# EAGLE design BLL-EBOOK-3506B (EAGLE 9.6.2)
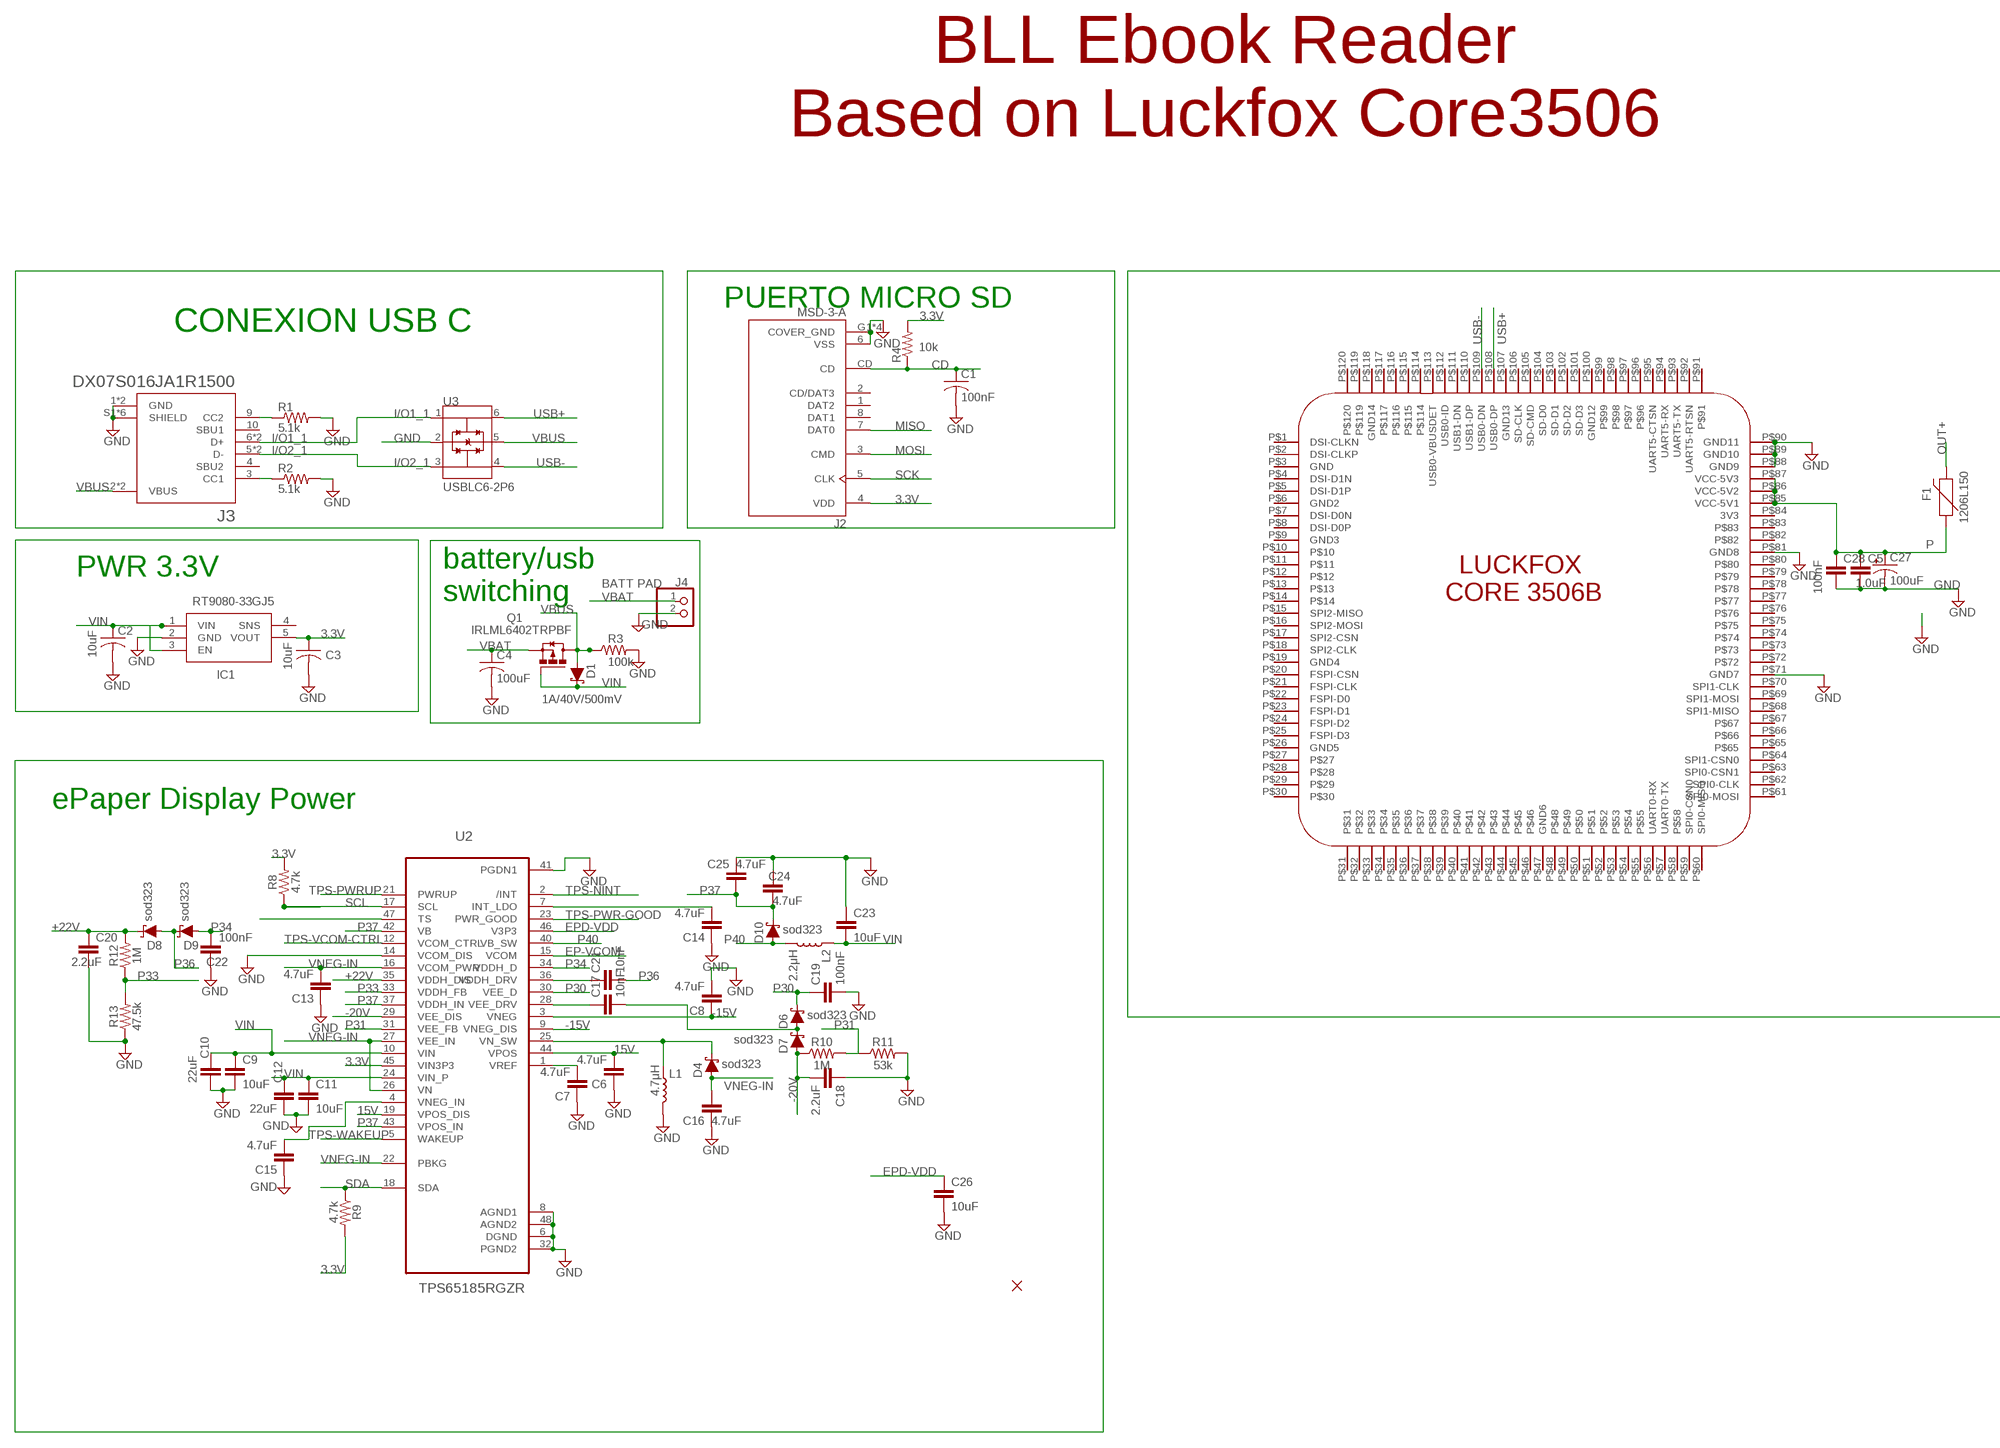
[diagram p0: schematic, sheet 1, part 1 of 2]
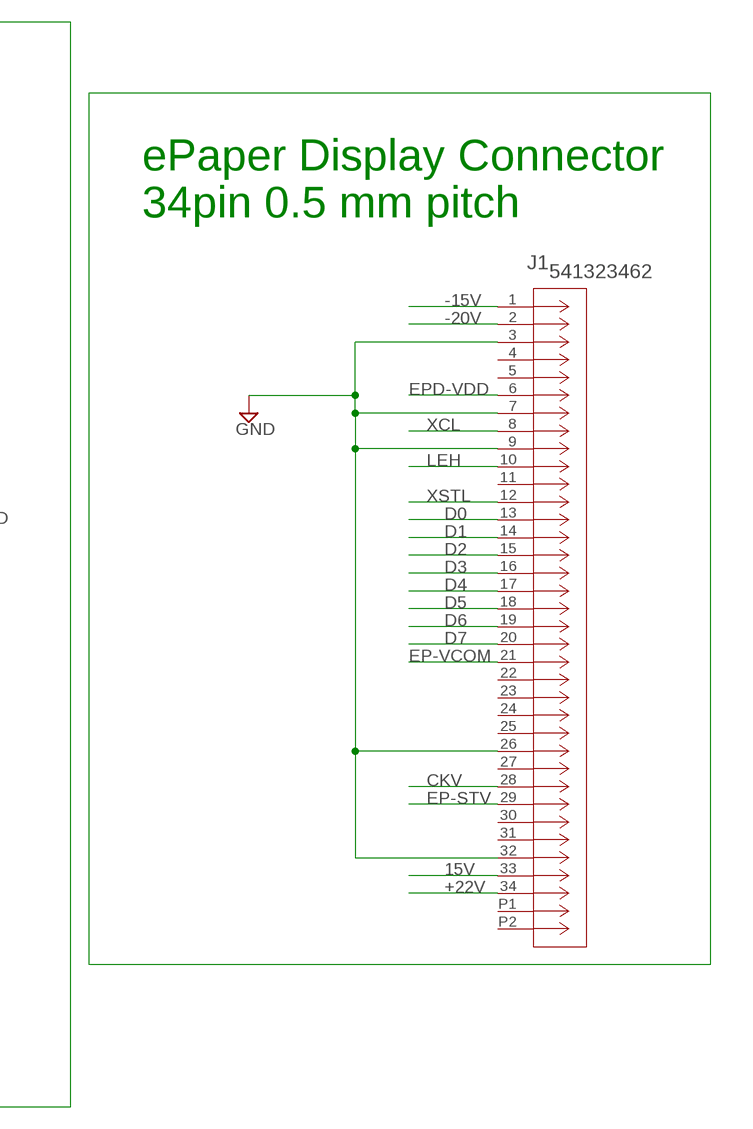
[diagram p1: schematic, sheet 1, part 2 of 2]

## Parts
C1  100nF  C-USC0603  [C0603]
C2  10uF  C-USC0603  [C0603]
C3  10uF  C-USC0603  [C0603]
C4  100uF  C-USC0603  [C0603]
C5  1.0uF  1.0UF-0603-16V-10%-X7R  [0603]
C6  4.7uF  4.7UF-0603-35V-(20%)  [0603]
C7  4.7uF  4.7UF-0603-35V-(20%)  [0603]
C8  4.7uF  4.7UF-0603-35V-(20%)  [0603]
C9  10uF  10UF-0805-10V-10%  [0805]
C10  22uF  22UF-0805-16V-20%  [0805]
C11  10uF  10UF-0805-10V-10%  [0805]
C12  22uF  22UF-0805-16V-20%  [0805]
C13  4.7uF  4.7UF-0603-35V-(20%)  [0603]
C14  4.7uF  4.7UF-0603-35V-(20%)  [0603]
C15  4.7uF  4.7UF-0603-35V-(20%)  [0603]
C16  4.7uF  4.7UF-0603-35V-(20%)  [0603]
C17  10nF  10NF-0603-50V-10%  [0603]
C18  2.2uF  2.2UF-1206-50V-10%  [1206]
C19  100nF  DNP-0603  [0603]
C20  2.2uF  2.2UF-1206-50V-10%  [1206]
C21  10nF  10NF-0603-50V-10%  [0603]
C22  100nF  DNP-0603  [0603]
C23  10uF  10UF-0805-10V-10%  [0805]
C24  4.7uF  4.7UF-0603-35V-(20%)  [0603]
C25  4.7uF  4.7UF-0603-35V-(20%)  [0603]
C26  10uF  10UF-0805-10V-10%  [0805]
C27  100uF  100UF-POLAR-EIA3528-10V-20%(TANT)  [EIA3528]
C28  100nF  CAP-0805  [0805]
D1  1A/40V/500mV  DIODE-SCHOTTKY-SS14  [SMA-DIODE]
D4  sod323  DIODE-SCHOTTKY-PMEG4005EJ  [SOD-323]
D6  sod323  DIODE-SCHOTTKY-PMEG4005EJ  [SOD-323]
D7  sod323  DIODE-SCHOTTKY-PMEG4005EJ  [SOD-323]
D8  sod323  DIODE-SCHOTTKY-PMEG4005EJ  [SOD-323]
D9  sod323  DIODE-SCHOTTKY-PMEG4005EJ  [SOD-323]
D10  sod323  DIODE-SCHOTTKY-PMEG4005EJ  [SOD-323]
F1  1206L150  PPTC_6V500MA-2  [1206]
IC1  RT9080-33GJ5  [SOT94P280X100-5N]
J1  541323462  [CON_541323462_MOL]
J2  MSD-3-A  [CUI_MSD-3-A]
J3  DX07S016JA1R1500  [JAE_DX07S016JA1R1500]
J4  BATT PAD  PINHD-1X2/90  [1X02/90]
L1  4.7μH  4.7μH_SHIELDED_INDUCTOR  [1008(2520)]
L2  2.2μH  2.2μH_SHIELDED_INDUCTOR  [0806]
Q1  IRLML6402TRPBF  [SOT23]
R1  5.1k  R-US_M0805  [M0805]
R2  5.1k  R-US_M0805  [M0805]
R3  100k  R-US_R0603  [R0603]
R4  10k  R-US_M0805  [M0805]
R8  4.7k  4.7KOHM-0603-1/10W-1%  [0603]
R9  4.7k  4.7KOHM-0603-1/10W-1%  [0603]
R10  1M  1MOHM-0603-1/4W-5%  [0603]
R11  53k  RESISTOR0805  [0805]
R12  1M  1MOHM-0603-1/4W-5%  [0603]
R13  47.5k  RESISTOR0805  [0805]
U2  TPS65185RGZR  [QFN50P700X700X100-49N]
U3  USBLC6-2P6  [SOT50P160X60-6N]
U$1  LUCKFOX_CORE3506  [CORE3506]

## Nets
3.3V: C3.1 IC1.5(VOUT) J2.4(VDD) R4.2 R8.2 R9.2 U2.45(VIN3P3)
15V: C6.2 J1.33 U2.19(VPOS_DIS) U2.44(VPOS)
+22V: C20.1 D8.C J1.34 R12.2 U2.35(VDDH_DIS)
-15V: C8.1 J1.1 U2.3(VNEG) U2.9(VNEG_DIS)
-20V: C18.2 D7.A J1.2 R10.1 U2.29(VEE_DIS)
CD: C1.1 J2.CD R4.1
CKV: J1.28
D0: J1.13
D1: J1.14
D2: J1.15
D3: J1.16
D4: J1.17
D5: J1.18
D6: J1.19
D7: J1.20
EP-STV: J1.29
EP-VCOM: J1.21 U2.15(VCOM)
EPD-VDD: C26.1 J1.6 U2.46(V3P3)
GND: C1.2 C2.2 C3.2 C4.2 C5.2 C6.1 C7.1 C8.2 C9.2 C10.2 C11.2 C12.2 C13.1 C14.1 C15.1 C16.1 C18.1 C19.2 C20.2 C22.1 C23.1 C24.2 C25.2 C26.2 C27.C(-) C28.2 IC1.2(GND) J1.3 J1.7 J1.9 J1.26 J1.32 J2.6(VSS) J2.G1(COVER_GND) J2.G2(COVER_GND) J2.G3(COVER_GND) J2.G4(COVER_GND) J3.1(GND) J3.12(GND) J3.S1(SHIELD) J3.S2(SHIELD) J3.S3(SHIELD) J3.S4(SHIELD) J3.S5(SHIELD) J3.S6(SHIELD) J4.2 L1.2 R1.2 R2.2 R3.2 R11.2 R13.1 U2.6(DGND) U2.8(AGND1) U2.14(VCOM_DIS) U2.32(PGND2) U2.41(PGDN1) U2.48(AGND2) U3.2(GND) U$1.P$71(GND7) U$1.P$81(GND8) U$1.P$88(GND9) U$1.P$89(GND10) U$1.P$90(GND11)
I/O1_1: J3.6(D+) J3.7(D+) U3.1(I/O1_1)
I/O2_1: J3.5(D-) J3.8(D-) U3.3(I/O2_1)
LEH: J1.10
MISO: J2.7(DAT0)
MOSI: J2.3(CMD)
N$3: J3.3(CC1) R2.1
N$4: J3.9(CC2) R1.1
N$11: U2.47(TS)
N$12: C7.2 U2.1(VREF)
N$13: C15.2 U2.4(VNEG_IN)
N$14: C14.2 U2.7(INT_LDO)
N$15: D4.C L1.1 U2.25(VN_SW)
N$16: C17.1 U2.28(VEE_DRV)
N$17: C17.2 D6.A D7.C
N$19: C21.1 U2.36(VDDH_DRV)
OUT+: F1.2
P: C5.1 C27.A(+) C28.1 F1.1 U$1.P$85(VCC-5V1) U$1.P$86(VCC-5V2) U$1.P$87(VCC-5V3)
P30: C19.1 D6.C U2.30(VEE_D)
P31: R10.2 R11.1 U2.31(VEE_FB)
P33: R12.1 R13.2 U2.33(VDDH_FB)
P34: C22.2 D9.A U2.34(VDDH_D)
P36: C21.2 D8.A D9.C
P37: C24.1 C25.1 D10.C U2.37(VDDH_IN) U2.42(VB) U2.43(VPOS_IN)
P40: D10.A L2.2 U2.40(VB_SW)
SCK: J2.5(CLK)
SCL: R8.1 U2.17(SCL)
SDA: R9.1 U2.18(SDA)
TPS-NINT: U2.2(/INT)
TPS-PWR-GOOD: U2.23(PWR_GOOD)
TPS-PWRUP: U2.21(PWRUP)
TPS-VCOM-CTRL: U2.12(VCOM_CTRL)
TPS-WAKEUP: U2.5(WAKEUP)
USB+: U3.6(I/O1_2) U$1.P$108(USB0-DP)
USB-: U3.4(I/O2_2) U$1.P$109(USB0-DN)
VBAT: C4.1 J4.1 Q1.2(S)
VBUS: D1.A J3.2(VBUS) J3.11(VBUS) Q1.3(D) R3.1 U3.5(VBUS)
VIN: C2.1 C9.1 C10.1 C11.1 C12.1 C23.2 D1.C IC1.1(VIN) IC1.3(EN) L2.1 Q1.1(G) U2.10(VIN) U2.24(VIN_P)
VNEG-IN: C13.2 C16.2 D4.A U2.16(VCOM_PWR) U2.22(PBKG) U2.26(VN) U2.27(VEE_IN)
XCL: J1.8
XSTL: J1.12
Unconnected: IC1.4(SNS) J1.4 J1.5 J1.11 J1.22 J1.23 J1.24 J1.25 J1.27 J1.30 J1.31 J1.P1 J1.P2 J2.1(DAT2) J2.2(CD/DAT3) J2.8(DAT1) J3.4(SBU2) J3.10(SBU1) U$1.P$1(DSI-CLKN) U$1.P$2(DSI-CLKP) U$1.P$3(GND) U$1.P$4(DSI-D1N) U$1.P$5(DSI-D1P) U$1.P$6(GND2) U$1.P$7(DSI-D0N) U$1.P$8(DSI-D0P) U$1.P$9(GND3) U$1.P$10 U$1.P$11 U$1.P$12 U$1.P$13 U$1.P$14 U$1.P$15(SPI2-MISO) U$1.P$16(SPI2-MOSI) U$1.P$17(SPI2-CSN) U$1.P$18(SPI2-CLK) U$1.P$19(GND4) U$1.P$20(FSPI-CSN) U$1.P$21(FSPI-CLK) U$1.P$22(FSPI-D0) U$1.P$23(FSPI-D1) U$1.P$24(FSPI-D2) U$1.P$25(FSPI-D3) U$1.P$26(GND5) U$1.P$27 U$1.P$28 U$1.P$29 U$1.P$30 U$1.P$31 U$1.P$32 U$1.P$33 U$1.P$34 U$1.P$35 U$1.P$36 U$1.P$37 U$1.P$38 U$1.P$39 U$1.P$40 U$1.P$41 U$1.P$42 U$1.P$43 U$1.P$44 U$1.P$45 U$1.P$46 U$1.P$47(GND6) U$1.P$48 U$1.P$49 U$1.P$50 U$1.P$51 U$1.P$52 U$1.P$53 U$1.P$54 U$1.P$55 U$1.P$56(UART0-RX) U$1.P$57(UART0-TX) U$1.P$58 U$1.P$59(SPI0-CSN0) U$1.P$60(SPI0-MISO) U$1.P$61(SPI0-MOSI) U$1.P$62(SPI0-CLK) U$1.P$63(SPI0-CSN1) U$1.P$64(SPI1-CSN0) U$1.P$65 U$1.P$66 U$1.P$67 U$1.P$68(SPI1-MISO) U$1.P$69(SPI1-MOSI) U$1.P$70(SPI1-CLK) U$1.P$72 U$1.P$73 U$1.P$74 U$1.P$75 U$1.P$76 U$1.P$77 U$1.P$78 U$1.P$79 U$1.P$80 U$1.P$82 U$1.P$83 U$1.P$84(3V3) U$1.P$91 U$1.P$92(UART5-RTSN) U$1.P$93(UART5-TX) U$1.P$94(UART5-RX) U$1.P$95(UART5-CTSN) U$1.P$96 U$1.P$97 U$1.P$98 U$1.P$99 U$1.P$100(GND12) U$1.P$101(SD-D3) U$1.P$102(SD-D2) U$1.P$103(SD-D1) U$1.P$104(SD-D0) U$1.P$105(SD-CMD) U$1.P$106(SD-CLK) U$1.P$107(GND13) U$1.P$110(USB1-DP) U$1.P$111(USB1-DN) U$1.P$112(USB0-ID) U$1.P$113(USB0-VBUSDET) U$1.P$114 U$1.P$115 U$1.P$116 U$1.P$117 U$1.P$118(GND14) U$1.P$119 U$1.P$120

## Notes on the sheet
- BLL Ebook Reader
  Based on Luckfox Core3506
- PUERTO MICRO SD
- CONEXION USB C
- ePaper Display Connector
  34pin 0.5 mm pitch
- PWR 3.3V
- battery/usb 
  switching
- ePaper Display Power

## Library data of the parts
C1-C4 = rcl:C-US: CAPACITOR, American symbol; SPICEPREFIX: C
C5 = SparkFun-Capacitors:1.0UF: 1µF ceramic capacitors A capacitor is a passive two-terminal electrical component used to store electrical energy temporarily in an electric field.; PROD_ID: CAP-13930
C6-C8 C13-C16 C24 C25 = SparkFun-Capacitors:4.7UF: 4.7µF ceramic capacitors A capacitor is a passive two-terminal electrical component used to store electrical energy temporarily in an electric field.; PROD_ID: CAP-14106
C9 C11 C23 C26 = SparkFun-Capacitors:10UF: 10.0µF ceramic capacitors A capacitor is a passive two-terminal electrical component used to store electrical energy temporarily in an electric field.; PROD_ID: CAP-11330
C10 C12 = SparkFun-Capacitors:22UF: 22µF ceramic capacitors A capacitor is a passive two-terminal electrical component used to store electrical energy temporarily in an electric field.; PROD_ID: CAP-14260
C17 C21 = SparkFun-Capacitors:10NF: 0.01uF/10nF/10,000pF ceramic capacitors A capacitor is a passive two-terminal electrical component used to store electrical energy temporarily in an electric field. CAP-09321; PROD_ID: CAP-00867
C18 C20 = SparkFun-Capacitors:2.2UF: 2.2µF ceramic capacitors A capacitor is a passive two-terminal electrical component used to store electrical energy temporarily in an electric field.; PROD_ID: CAP-10009
C19 C22 = SparkFun-Capacitors:DNP: Do-Not-Populate capacitor; VALUE: DNP
C27 = SparkFun-Capacitors:100UF-POLAR: 100µF polarized capacitors A capacitor is a passive two-terminal electrical component used to store electrical energy temporarily in an electric field.; PROD_ID: CAP-16823
C28 = SparkFun-Capacitors:CAP
D1 = SparkFun-DiscreteSemi:DIODE-SCHOTTKY: Schottky diode A Schottky diode is a semiconductor diode which has a low forward voltage drop and a very fast switching action.; PROD_ID: DIO-08053
D4 D6-D10 = SparkFun-DiscreteSemi:DIODE-SCHOTTKY: Schottky diode A Schottky diode is a semiconductor diode which has a low forward voltage drop and a very fast switching action.; PROD_ID: DIO-10955; VALUE: 0.5A/40V/420mV
F1 = SparkFun-Fuses:PPTC: Resettable Fuse PPTC Resettable Fuse. Really a sort of resistor with a polymeric positive temperature coefficient whose resistance increases dramatically with an increase in temperature. When heated by the power passing through the resistance rises causing the current to be limited, protecting the circuit. This is achieved by the transition of the polymer from a crystalline to an amorphous state where the conductive carbon separates breaking the conductive pathways found in the cool crystalline structure. When a PPTC cools back down it resumes conducting letting the circuit turn back on. SparkFun Products: SparkFun RedBoard - Programmed with Arduino <https://www.sparkfun.com/products/12757> Pro Micro - 5V/16MHz <https://www.sparkfun.com/products/12640> Arduino Pro 328 - 5V/16MHz <https://www.sparkfun.com/products/10915> MP3 Trigger <https://www.sparkfun.com/products/13720>; PROD_ID: RES-08585; VALUE: 6V/0.5A
IC1 = RT9080-33GJ5:RT9080-33GJ5: Check availability <https://pricing.snapeda.com/parts/RT9080-33GJ5/Richtek%20USA/view-part?ref=eda>; AVAILABILITY: In Stock; CHECK_PRICES: https://www.snapeda.com/parts/RT9080-33GJ5/Richtek/view-part/?ref=eda; DESCRIPTION: Linear Voltage Regulator IC Positive Fixed 1 Output 600mA TSOT-23-5; MF: Richtek USA; MP: RT9080-33GJ5; PACKAGE: TSOT-23 Richtek; PRICE: None; SNAPEDA_LINK: https://www.snapeda.com/parts/RT9080-33GJ5/Richtek/view-part/?ref=snap
J1 = molex fpc 34p 0.5mm :541323462: Check availability <https://pricing.snapeda.com/parts/541323462/Molex/view-part?ref=eda>; AVAILABILITY: In Stock; CHECK_PRICES: https://www.snapeda.com/parts/541323462/Molex/view-part/?ref=eda; DESCRIPTION: 34 Position FFC, FPC Connector Contacts, Bottom 0.020 (0.50mm) Surface Mount, Right Angle; MF: Molex; MP: 541323462; PACKAGE: None; PRICE: None; SNAPEDA_LINK: https://www.snapeda.com/parts/541323462/Molex/view-part/?ref=snap
J2 = MSD-3-A:MSD-3-A: Check availability <https://pricing.snapeda.com/parts/MSD-3-A/Same%20Sky/view-part?ref=eda>; AVAILABILITY: In Stock; CHECK_PRICES: https://www.snapeda.com/parts/MSD-3-A/Same+Sky/view-part/?ref=eda; DESCRIPTION: Micro SD Card Connector, 9 Positions, Connector and Ejector, Push In, Auto Eject Out, Surface Mount, 0.95 mm Height Above Board, Gold Flash; MF: Same Sky; MP: MSD-3-A; PACKAGE: None; PRICE: None; SNAPEDA_LINK: https://www.snapeda.com/parts/MSD-3-A/Same+Sky/view-part/?ref=snap
J3 = DX07S016JA1R1500- usb c:DX07S016JA1R1500: Check availability <https://pricing.snapeda.com/parts/DX07S016JA1R1500/JAE%20Electronics/view-part?ref=eda>; AVAILABILITY: In Stock; CHECK_PRICES: https://www.snapeda.com/parts/DX07S016JA1R1500/JAE+Electronics/view-part/?ref=eda; DESCRIPTION: USB-C (USB TYPE-C) USB 2.0 Receptacle Connector 24 (16+8 Dummy) Position Surface Mount, Right Angle; Through Hole; MF: JAE Electronics; MP: DX07S016JA1R1500; PACKAGE: None; PRICE: None; SNAPEDA_LINK: https://www.snapeda.com/parts/DX07S016JA1R1500/JAE+Electronics/view-part/?ref=snap
J4 = pinhead:PINHD-1X2: PIN HEADER
L1 = SparkFun-Coils:4.7μH_SHIELDED_INDUCTOR: 4.7uH Inductor 4.7uH 1.4A 50mOhm 1008(2520) Package Shielded; PROD_ID: NDUC-14880
L2 = SparkFun-Coils:2.2μH_SHIELDED_INDUCTOR: Murata 2.2uH Inductor 2.2uH 1.2A 110mOhm 0806 Package Shielded Bourns 2.2uH Inductor 2.2uH 5.5A 205mOhm 5x5mm Package Shielded; PROD_ID: NDUC-14257
Q1 = IRLML6402:IRLML6402: Check availability <https://pricing.snapeda.com/parts/IRLML6402/Infineon%20Technologies/view-part?ref=eda>; AVAILABILITY: In Stock; CHECK_PRICES: https://www.snapeda.com/parts/IRLML6402/Infineon/view-part/?ref=eda; DESCRIPTION: P-Channel 20 V 3.7A (Ta) 1.3W (Ta) Surface Mount Micro3â„¢ /SOT-23; MF: Infineon Technologies; MP: IRLML6402; PACKAGE: SOT-23-3 ON Semiconductor; PRICE: None; SNAPEDA_LINK: https://www.snapeda.com/parts/IRLML6402/Infineon/view-part/?ref=snap
R1-R4 = rcl:R-US_: RESISTOR, American symbol; SPICEPREFIX: R
R8 R9 = SparkFun-Resistors:4.7KOHM: 4.7kΩ resistor A resistor is a passive two-terminal electrical component that implements electrical resistance as a circuit element. Resistors act to reduce current flow, and, at the same time, act to lower voltage levels within circuits. - Wikipedia; PROD_ID: RES-07857
R10 R12 = SparkFun-Resistors:1MOHM: 1MΩ resistor A resistor is a passive two-terminal electrical component that implements electrical resistance as a circuit element. Resistors act to reduce current flow, and, at the same time, act to lower voltage levels within circuits. - Wikipedia; PROD_ID: RES-07868
R11 R13 = SparkFun-Resistors:RESISTOR: Generic Resistor Package
U2 = TPS65185RGZR:TPS65185RGZR: Check availability <https://pricing.snapeda.com/parts/TPS65185RGZR/Texas%20Instruments/view-part?ref=eda>; AVAILABILITY: In Stock; CHECK_PRICES: https://www.snapeda.com/parts/TPS65185RGZR/Texas+Instruments/view-part/?ref=eda; DESCRIPTION: PMIC for E-Ink® Vizplex™ Enabled Electronic Paper Display w/ Active Discharge; MF: Texas Instruments; MP: TPS65185RGZR; PACKAGE: VQFN-48 Texas Instruments; PRICE: None; SNAPEDA_LINK: https://www.snapeda.com/parts/TPS65185RGZR/Texas+Instruments/view-part/?ref=snap
U3 = USBLC6-2P6:USBLC6-2P6: Check availability <https://pricing.snapeda.com/parts/USBLC6-2P6/STMicroelectronics/view-part?ref=eda>; AVAILABILITY: In Stock; CHECK_PRICES: https://www.snapeda.com/parts/USBLC6-2P6/STMicroelectronics/view-part/?ref=eda; DESCRIPTION: 17V Clamp 5A (8/20µs) Ipp Tvs Diode Surface Mount SOT-666; MF: STMicroelectronics; MP: USBLC6-2P6; PACKAGE: SOT-666 STMicroelectronics; PRICE: None; SNAPEDA_LINK: https://www.snapeda.com/parts/USBLC6-2P6/STMicroelectronics/view-part/?ref=snap
U$1 = Luckfox_Core3506:LUCKFOX_CORE3506: Módulo SOM compacto de 32 mm × 32 mm basado en el chip Rockchip RK3506B. Incluye procesador de cuatro núcleos (3× Cortex-A7 + 1× Cortex-M0), 512 MB de RAM DDR3L externa y almacenamiento eMMC de 8 GB. Ofrece 120 pines tipo stamp hole con múltiples interfaces (SPI, I2C, UART, USB, GPIO, SDIO), ideal para sistemas embebidos de bajo consumo. Compatible con expansión externa vía USB y adaptable a proyectos personalizados como lectores E-Ink, interfaces gráficas simples o dispositivos portátiles. Requiere placa base para su funcionamiento. No incluye WiFi integrado, pero puede añadirse mediante dongle USB o usando la versión Lyra W.

## Board
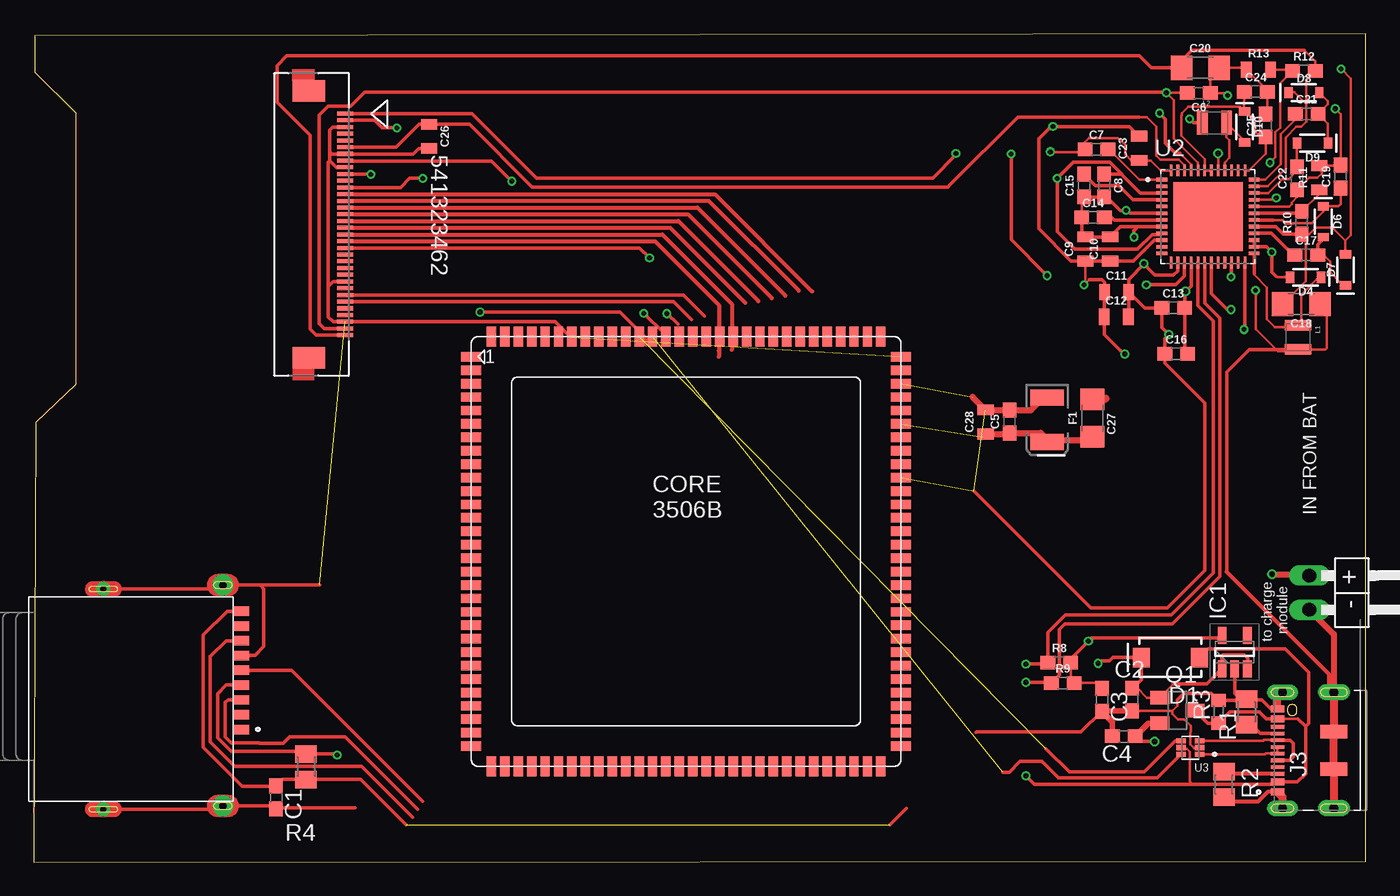
[diagram p2: board, top side]
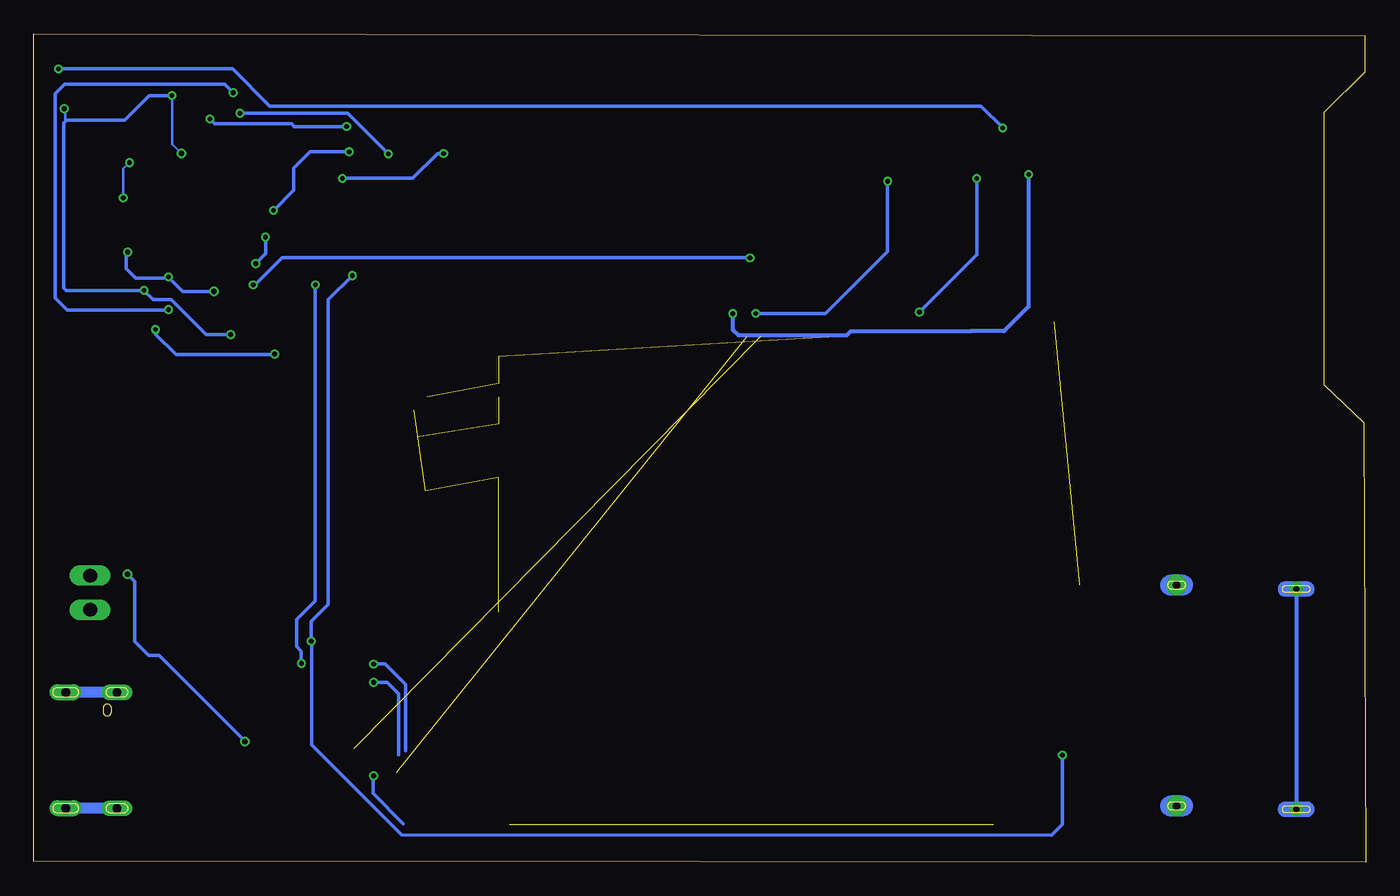
[diagram p3: board, bottom side, seen from below]

Size 99.21 x 61.71 mm. Coordinates in mm from the lower left corner, seen from the top.
Outline: 0,0 99.19,0.05 99.21,61.71 0.1,61.56 0.1,58.83 3.12,55.8 3.12,35.59 0.15,32.74 0,0
Copper layers (1*16): Top 0.035mm / dielectric 1.5mm / Bottom 0.035mm
Design rules "default *": minimum track width 6.5mil, minimum drill 0.15mm, track to track 6.5mil, track to pad 0.1mm, pad to pad 0.15mm, via to via 6mil, smd to smd 0.15mm, copper to edge 40mil, drill to drill 0.2mm, minimum pad ring 10mil, minimum via ring 0.15mm, stop-mask expansion 4mil, vias tented up to drill 0mil, thermal gap 10mil

### Footprints (pad centres in the part's own frame; a part is rotated, then mirrored left to right if it is on the bottom)
C0603 = smd 1.1 x 1: 1 -0.85,0; 2 0.85,0
0603 = smd 1.1 x 1: 1 -0.85,0; 2 0.85,0
0805 = smd 0.8 x 1.2: 1 -0.9,0; 2 0.9,0
1206 = smd 1.6 x 1.8: 1 -1.4,0; 2 1.4,0
EIA3528 = smd 1.2 x 2.5: A 1.65,0; C -1.65,0
SMA-DIODE = smd 1.27 x 1.47: A -2.15,0; C 2.15,0
SOD-323 = smd 0.63 x 0.83: A 1.15,0; C -1.15,0
SOT94P280X100-5N = smd 1.25 x 0.65: 1 -1.25,0.94; 2 -1.25,0; 3 -1.25,-0.94; 4 1.25,-0.94; 5 1.25,0.94
CON_541323462_MOL = smd 0.3 x 1.2: 1 -8.25,2.498; 2 -7.75,2.498; 3 -7.25,2.498; 4 -6.75,2.498; 5 -6.25,2.498; 6 -5.75,2.498; 7 -5.25,2.498; 8 -4.75,2.498; 9 -4.25,2.498; 10 -3.75,2.498; 11 -3.25,2.498; 12 -2.75,2.498; 13 -2.25,2.498; 14 -1.75,2.498; 15 -1.25,2.498; 16 -0.75,2.498; 17 -0.25,2.498; 18 0.25,2.498; 19 0.75,2.498; 20 1.25,2.498; 21 1.75,2.498; 22 2.25,2.498; 23 2.75,2.498; 24 3.25,2.498; 25 3.75,2.498; 26 4.25,2.498; 27 4.75,2.498; 28 5.25,2.498; 29 5.75,2.498; 30 6.25,2.498; 31 6.75,2.498; 32 7.25,2.498; 33 7.75,2.498; 34 8.25,2.498 | smd 1.6 x 2.4: P1 -9.95,-0.202; P2 9.95,-0.202
CUI_MSD-3-A = smd 0.7 x 1.2: 1 2.25,8.2; 2 1.15,8.2; 3 0.05,8.2; 4 -1.05,8.2; 5 -2.15,8.2; 6 -3.25,8.2; 7 -4.35,8.2; 8 -5.45,8.2; CD -6.55,8.2 | drill 0.55 pad 1.55: G1 -8.5,6.85; G2 7.95,6.85 | drill 0.45 pad 1.05: G3 -8.2,-2.05; G4 8.2,-2.05
JAE_DX07S016JA1R1500 = smd 0.52 x 1: 1 -3.1,1.1; 2 -2.35,1.1; 11 2.35,1.1; 12 3.1,1.1 | smd 0.27 x 1: 3 -1.75,1.1; 4 -1.25,1.1; 5 -0.75,1.1; 6 -0.25,1.1; 7 0.25,1.1; 8 0.75,1.1; 9 1.25,1.1; 10 1.75,1.1 | smd 1 x 2: S1 -1.4,-3.1; S2 1.4,-3.1 | drill 0.65 long: S3 -4.32,0.725; S4 4.32,0.725 | drill 0.65 pad 1.2 long: S5 -4.32,-3.1; S6 4.32,-3.1
1X02/90 = drill 1.016 long: 1 -1.27,-3.81; 2 1.27,-3.81
1008(2520) = smd 0.8 x 2: 1 -0.9,0; 2 0.9,0
0806 = smd 0.8 x 1.8: 1 -0.9,0; 2 0.9,0
SOT23 = smd 1 x 1.4: 1 -0.95,-1.306; 2 0.95,-1.306; 3 0,1.306
M0805 = smd 1.3 x 1.6: 1 -0.95,0; 2 0.95,0
R0603 = smd 1 x 1.1: 1 -0.85,0; 2 0.85,0
QFN50P700X700X100-49N = smd 0.86 x 0.26: 1 -3.435,2.75; 2 -3.435,2.25; 3 -3.435,1.75; 4 -3.435,1.25; 5 -3.435,0.75; 6 -3.435,0.25; 7 -3.435,-0.25; 8 -3.435,-0.75; 9 -3.435,-1.25; 10 -3.435,-1.75; 11 -3.435,-2.25; 12 -3.435,-2.75; 25 3.435,-2.75; 26 3.435,-2.25; 27 3.435,-1.75; 28 3.435,-1.25; 29 3.435,-0.75; 30 3.435,-0.25; 31 3.435,0.25; 32 3.435,0.75; 33 3.435,1.25; 34 3.435,1.75; 35 3.435,2.25; 36 3.435,2.75 | smd 0.26 x 0.86: 13 -2.75,-3.435; 14 -2.25,-3.435; 15 -1.75,-3.435; 16 -1.25,-3.435; 17 -0.75,-3.435; 18 -0.25,-3.435; 19 0.25,-3.435; 20 0.75,-3.435; 21 1.25,-3.435; 22 1.75,-3.435; 23 2.25,-3.435; 24 2.75,-3.435; 37 2.75,3.435; 38 2.25,3.435; 39 1.75,3.435; 40 1.25,3.435; 41 0.75,3.435; 42 0.25,3.435; 43 -0.25,3.435; 44 -0.75,3.435; 45 -1.25,3.435; 46 -1.75,3.435; 47 -2.25,3.435; 48 -2.75,3.435 | smd 5.15 x 5.15: 49 0,0
SOT50P160X60-6N = smd 0.75 x 0.35: 1 -0.69,0.5; 2 -0.69,0; 3 -0.69,-0.5; 4 0.69,-0.5; 5 0.69,0; 6 0.69,0.5
CORE3506 = smd 1.5 x 0.7: P$1 -16,14.5; P$2 -16,13.5; P$3 -16,12.5; P$4 -16,11.5; P$5 -16,10.5; P$6 -16,9.5; P$7 -16,8.5; P$8 -16,7.5; P$9 -16,6.5; P$10 -16,5.5; P$11 -16,4.5; P$12 -16,3.5; P$13 -16,2.5; P$14 -16,1.5; P$15 -16,0.5; P$16 -16,-0.5; P$17 -16,-1.5; P$18 -16,-2.5; P$19 -16,-3.5; P$20 -16,-4.5; P$21 -16,-5.5; P$22 -16,-6.5; P$23 -16,-7.5; P$24 -16,-8.5; P$25 -16,-9.5; P$26 -16,-10.5; P$27 -16,-11.5; P$28 -16,-12.5; P$29 -16,-13.5; P$30 -16,-14.5; P$61 16,-14.5; P$62 16,-13.5; P$63 16,-12.5; P$64 16,-11.5; P$65 16,-10.5; P$66 16,-9.5; P$67 16,-8.5; P$68 16,-7.5; P$69 16,-6.5; P$70 16,-5.5; P$71 16,-4.5; P$72 16,-3.5; P$73 16,-2.5; P$74 16,-1.5; P$75 16,-0.5; P$76 16,0.5; P$77 16,1.5; P$78 16,2.5; P$79 16,3.5; P$80 16,4.5; P$81 16,5.5; P$82 16,6.5; P$83 16,7.5; P$84 16,8.5; P$85 16,9.5; P$86 16,10.5; P$87 16,11.5; P$88 16,12.5; P$89 16,13.5; P$90 16,14.5 | smd 0.7 x 1.5: P$31 -14.5,-16; P$32 -13.5,-16; P$33 -12.5,-16; P$34 -11.5,-16; P$35 -10.5,-16; P$36 -9.5,-16; P$37 -8.5,-16; P$38 -7.5,-16; P$39 -6.5,-16; P$40 -5.5,-16; P$41 -4.5,-16; P$42 -3.5,-16; P$43 -2.5,-16; P$44 -1.5,-16; P$45 -0.5,-16; P$46 0.5,-16; P$47 1.5,-16; P$48 2.5,-16; P$49 3.5,-16; P$50 4.5,-16; P$51 5.5,-16; P$52 6.5,-16; P$53 7.5,-16; P$54 8.5,-16; P$55 9.5,-16; P$56 10.5,-16; P$57 11.5,-16; P$58 12.5,-16; P$59 13.5,-16; P$60 14.5,-16; P$91 14.5,16; P$92 13.5,16; P$93 12.5,16; P$94 11.5,16; P$95 10.5,16; P$96 9.5,16; P$97 8.5,16; P$98 7.5,16; P$99 6.5,16; P$100 5.5,16; P$101 4.5,16; P$102 3.5,16; P$103 2.5,16; P$104 1.5,16; P$105 0.5,16; P$106 -0.5,16; P$107 -1.5,16; P$108 -2.5,16; P$109 -3.5,16; P$110 -4.5,16; P$111 -5.5,16; P$112 -6.5,16; P$113 -7.5,16; P$114 -8.5,16; P$115 -9.5,16; P$116 -10.5,16; P$117 -11.5,16; P$118 -12.5,16; P$119 -13.5,16; P$120 -14.5,16

### Placement (x,y rotation side)
C1  18.06,4.83 270 top
C2  81.79,12.12 270 top
C3  79.55,12.09 270 top
C4  81.18,9.37 180 top
C5  72.67,32.82 90 top
C6  86.77,57.28 180 top
C7  79.15,53.09 0 top
C8  79.73,50.39 270 top
C9  78.31,45.67 90 top
C10  80.16,45.67 90 top
C11  80.64,42.47 0 top
C12  80.62,40.61 0 top
C13  84.86,41.27 0 top
C14  78.89,48.01 0 top
C15  78.23,50.39 90 top
C16  85.09,37.85 0 top
C17  94.77,45.21 0 top
C18  94.39,41.55 180 top
C19  97.33,51.05 90 top
C20  86.87,59.16 0 top
C21  94.79,55.73 0 top
C22  94.08,50.93 90 top
C23  82.32,53.16 90 top
C24  91.01,57.38 0 top
C25  91.74,54.86 90 top
C26  29.44,54.05 270 top
C27  75.46,32.94 270 top
C28  70.89,32.79 90 top
D1  84.65,15.24 180 top
D4  94.72,43.56 180 top
D6  96.04,47.7 270 top
D7  97.69,44.12 90 top
D8  94.59,57.3 0 top
D9  95.22,53.54 180 top
D10  90.17,54.76 270 top
F1  78.84,33.07 90 top
IC1  89.43,15.65 90 top
J1  20.7,47.5 270 top
J2  7.25,12.14 270 top
J3  93.73,8.33 90 top
J4  98.81,20.07 270 top
L1  94.16,39.09 270 top
L2  87.93,55.07 0 top
Q1  85.17,11.3 270 top
R1  90.32,11.19 90 top
R2  88.65,5.79 270 top
R3  88.24,11.2 90 top
R4  20.29,7.11 90 top
R8  76.38,14.86 0 top
R9  76.63,13.34 0 top
R10  94.44,47.62 90 top
R11  95.73,50.98 90 top
R12  94.59,58.93 0 top
R13  91.21,59.03 0 top
U2  87.45,48.08 0 top
U3  86.14,8.53 180 top
U$1  48.59,23.14 0 top

### Tracks (layer width: path | path; a pad name or v marks a point on that pad's centre or on a via)
3.3V  (via drill 0.35)
  Top 0.203: U2.45 86.2,51.96 85.34,52.82 | R9.2 79.16,13.34 C3.1 | 77.23,13.59 R8.2 77.23,15.15
  Top 0.254: J2.4 14.33,13.19 13.69,12.55 13.69,9.27 14.71,8.26 20.1,8.26 R4.2 22.52,8.06 v22.61,7.98 | v75.46,43.69 72.8,46.36 v72.8,52.76 | v83.84,55.78 84.28,55.35 84.28,53.54 85,52.82 85.34,52.82 | 77.88,12.94 R9.2 77.23,13.59 | IC1.5 88.29,16.69 78.77,16.69 v78.54,16.46 77.23,15.15
  Bottom 0.254: v22.61,7.98 22.61,2.83 23.42,2.02 71.81,2.04 78.51,8.74 78.51,16.43 v78.54,16.46 78.54,17.93 77.27,19.2 77.27,41.88 v75.46,43.69 | v72.8,52.76 75.82,55.78 v83.84,55.78
15V  (via drill 0.35)
  Top 0.203: C6.2 85.89,57.3 v84.35,57.3 84.92,56.74 84.92,53.9 86.7,52.12 U2.44
  Top 0.254: v89.18,41.15 88.9,41.15 87.7,42.35 U2.19 | J1.33 21.62,39.75 21.26,40.11 21.26,55.63 21.92,56.29 23.62,56.29 24.66,57.33 84.33,57.33 v84.35,57.3
  Bottom 0.254: v84.35,57.3 84.99,57.94 96.88,57.94 97.59,57.23 97.59,42.01 96.7,41.12 89.2,41.12 v89.18,41.15
+22V
  Top 0.203: 94.77,56.44 94.77,56.39 94.77,55.14 94.39,54.77 94.04,54.77 93.24,53.98 93.24,51.66 91.91,50.33 U2.35 | 94.62,60.46 95.44,59.64 R12.2 94.77,58.26 94.77,56.44 | D8.C 93.44,57.33 93.88,57.33 94.77,56.44
  Top 0.254: J1.34 21.05,39.25 20.6,39.7 20.6,54.13 18.14,56.59 18.14,59.33 18.85,60.05 82.35,60.05 83.24,59.16 C20.1 85.47,59.66 86.26,60.46 94.62,60.46
-15V  (via drill 0.35)
  Top 0.25: U2.9 83.93,46.75 83.29,46.75 82.19,45.64 77.55,45.64 76.22,46.96 v76.22,50.93 | 66.95,50.95 68.68,52.68 v68.68,52.78
  Top 0.254: U2.3 82.43,49.83 81.01,51.24 | 81.01,51.24 81.04,51.24 80.14,52.15 77.44,52.15 v76.22,50.93 | 81.01,51.24 C8.1 | J1.1 32.64,55.75 37.44,50.95 66.95,50.95
  Bottom 0.254: v68.68,52.78 69.14,52.78 70.99,50.93 v76.22,50.93
-20V  (via drill 0.35)
  Top 0.203: C18.2 93.01,41.55 94.74,43.28 94.74,46.48 R10.1 95.01,46.78 95.48,47.24 96.72,47.24 97.68,46.29 | D7.A 97.69,46.28 97.68,46.29 | v97.36,59.08 98.09,58.35 98.09,47.5 98.09,46.7 97.68,46.29
  Top 0.254: J1.2 25.39,55.25 25.95,54.69 v27.05,54.69 | R10.1 93.07,46.78 92.51,47.33 U2.29
  Bottom 0.254: v97.36,59.08 84.4,59.08 81.63,56.31 28.67,56.31 v27.05,54.69
CD  (1 unrouted)
  Top 0.254: J2.CD 14.4,18.69 12.62,16.92 12.62,8.56 15.52,5.66 C1.1 18.54,6.16 R4.1 24.34,6.16 27.74,2.77 | 64.98,3.99 63.75,2.77
CKV
  Top 0.254: J1.28 48.41,42.25 49.98,40.67
D0
  Top 0.305: J1.13 50.73,49.75 57.98,42.5
D1
  Top 0.305: 56.98,42.55 50.28,49.25 J1.14
D2
  Top 0.305: J1.15 49.42,48.75 55.98,42.19
D3
  Top 0.305: J1.16 48.73,48.25 54.98,42
D4
  Top 0.305: J1.17 48.01,47.75 53.98,41.78
D5
  Top 0.305: J1.18 47.39,47.25 52.98,41.66
D6
  Top 0.305: J1.19 46.83,46.75 51.99,41.58 51.99,38.17
D7
  Top 0.305: J1.20 46.28,46.25 51.03,41.5 51.03,38.1 51.03,38.07 51.03,37.64
EP-STV
  Top 0.254: J1.29 47.64,41.75 48.98,40.4
EP-VCOM  (via drill 0.35)
  Top 0.254: J1.21 45.13,45.75 v45.87,45.01 | v82.85,43 85.04,43 85.7,43.67 U2.15
  Bottom 0.254: v45.87,45.01 80.72,45.01 82.78,42.95 82.8,42.95 v82.85,43
EPD-VDD
  Top 0.203: 82.35,55.5 82.88,55.5 83.62,54.76 83.62,52.6 83.9,52.32 85.3,52.32 85.7,51.92 U2.46
  Top 0.254: 82.35,55.5 73.3,55.5 68.25,50.44 68.1,50.29 37.14,50.29 32.48,54.95 C26.1 28.7,54.95 27,53.25 J1.6
GND  (via drill 0.35, 0.4)  (8 unrouted)
  Top 0.203: v90.99,42.58 90.99,39.71 92.63,38.07 94.04,38.07 L1.2 96.18,38.19 96.29,38.3 96.29,41.05 C18.1 | R11.2 95.91,51.88 | 95.91,51.88 97.28,51.88 97.33,51.93 | U2.32 93.52,48.83 93.68,48.99 93.68,49.13 94.08,49.53 C22.1 94.98,50.98 95.61,50.98 95.91,51.28 95.91,51.88 | R13.1 90.56,59.55 | v96.93,56.12 97.33,55.72 C19.2 | 91.46,55.71 C25.2 | v75.72,52.91 75.74,52.88 78.09,52.88 C7.1 78.3,53.63 78.59,53.92 80.75,53.92 81.28,53.39 81.28,52.73 81.75,52.26 C23.1 83.2,52.26 83.95,51.51 U2.48 | 91.74,55.41 C25.2 | C2.2 84.8,11.27 | 85.17,12.09 85.17,11.63 84.8,11.27 | U3.2 86.39,8.53 86.13,8.79 86.13,9.68 86.18,9.73 86.18,10.16 85.74,10.6 85.69,10.6 85.65,10.64 85.19,10.64 84.8,11.04 84.8,11.27 | C14.1 78.04,49.35 C15.1 | C20.2 88.37,59.16 | 88.37,59.16 90.18,59.16 R13.1 | v88.9,57.1 88.72,57.28 C6.1 87.62,58.41 88.37,59.16 | R13.1 91.86,57.48 C24.2 91.86,55.83 C25.2 | U2.41 88.2,52.77 v88.19,52.78
  Top 0.25: J3.1 92.24,5.23 | C16.1 84.24,37.17 87.22,34.19 87.22,33.12
  Top 0.254: J3.12 92.12,11.43 91.46,12.09 90.37,12.09 | 90.37,12.09 R1.2 | 90.37,12.09 90.33,12.05 89.97,12.05 | 89.97,12.05 R3.2 87.72,12.57 85.65,12.57 85.17,12.09 | 16.87,20.64 J2.G1 13.92,20.34 5.94,20.34 J2.G3 | 16.87,20.64 21.29,20.64 | C3.2 78,9.69 70.22,9.69 70.18,9.65 | J2.G4 13.97,3.94 J2.G2 | J2.G2 14.27,4.14 | J2.G2 17.84,4.19 C1.2 18.15,4.06 23.95,4.06 | J2.6 16.48,15.39 17.14,16.05 17.14,20.36 16.87,20.64 | 39.98,39.12 38.85,40.25 J1.32 22.31,40.25 21.95,40.61 21.95,42.88 | J1.26 22.32,43.25 21.95,42.88 | J1.3 22.26,54.75 22.05,54.53 22.05,52.93 | 22.05,52.93 22.23,52.75 J1.7 28.26,52.75 28.67,53.15 C26.2 | J1.9 22.56,51.74 22.05,52.25 | 22.05,52.25 22.05,52.93 | 21.95,42.88 21.95,52.15 22.05,52.25 | 82.24,47.33 80.92,47.33 C10.2 C9.2 78.04,46.84 C14.1 | 82.24,47.33 U2.8 | U2.6 81.63,48.33 81.4,48.56 81.38,48.56 v81.36,48.54 80.94,48.54 79.93,49.54 C8.2 C15.1 | C11.2 82.74,41.28 C13.1 84.01,39.81 v84.53,39.29 84.24,39 C16.1 | C12.2 81.55,40.64 C11.2 | v90.99,42.58 90.99,42.29 | 97.33,51.93 C19.2 | U2.14 85.2,44.03 84.89,43.71 83.49,43.71 82.68,44.53 | 82.68,44.53 v82.68,44.58 | v81.94,46.56 81.94,47.03 82.24,47.33 | C11.2 81.55,43.39 82.68,44.53 | L1.2 90.53,38.19 88.85,36.51 88.85,21.62 | IC1.2 89.43,12.59 89.97,12.05 | 87.22,33.12 87.22,21.74 84.42,18.94 78.74,18.94 70.03,27.65 | 72.64,33.69 C5.2
  Top 0.305: R2.2 88.97,4.52 91.19,4.52 91.9,5.23 92.24,5.23 | 96.83,3.81 J3.S5 | J3.S6 96.83,12.8 96.44,13.18 96.44,14.02 88.85,21.62
  Top 0.406: C2.2 79.58,11.27 C3.2 80.33,10.47 C4.2 | C27.C 75.46,34.36
  Top 0.457: 69.92,34.65 70.88,33.69 C28.2 72.64,33.69 | C5.2 74.28,33.67 75.21,34.59 C27.C | 96.62,12.86 J3.S6 96.83,16.97 J4.2
  Top 0.61: J3.1 93,4.86 J3.S3 | J3.12 92.63,12.28 J3.S4 | J3.S6 J3.S2 J3.S1 J3.S5
  Bottom 0.203: 96.86,55.16 96.86,56.05 v96.93,56.12 | v88.19,52.78 88.9,53.49 v88.9,57.1
  Bottom 0.254: v88.9,57.1 90.6,57.1 92.43,55.27 96.75,55.27 96.86,55.16 96.98,55.04 96.98,42.77 96.79,42.58 v90.99,42.58 90.3,41.88 88.95,41.88 86.36,39.29 v84.53,39.29 | v75.72,52.91 78.61,52.91 79.83,51.69 79.83,50.03 81.33,48.54 v81.36,48.54 | v82.68,44.58 81.94,45.31 v81.94,46.56
  Bottom 0.305: J2.G3 J2.G4
  Bottom 0.813: J3.S4 J3.S6 | J3.S3 J3.S5
I/O1_1
  Top 0.203: J3.7 J3.6 92.6,8.1 91.77,8.1 91.7,8.03 U3.1
I/O2_1
  Top 0.203: U3.3 91.56,9.03 91.62,9.09 92.61,9.09 J3.8
  Top 0.254: J3.8 93.59,9.08 93.8,8.86 93.8,7.85 93.53,7.58 J3.5
LEH  (via drill 0.35)
  Top 0.254: 47.98,40.06 47.17,40.87 v47.16,40.86 | v25.12,51.23 25.1,51.25 J1.10
  Bottom 0.254: 25.1,51.25 v25.12,51.23
  Bottom 0.305: v47.16,40.86 47.16,39.66 46.74,39.24 38.66,39.24 38.35,39.55 29.62,39.55 29.41,39.55 26.95,39.55 25.12,41.38 v25.12,51.23
MISO
  Top 0.254: J2.7 14.33,16.49 13.16,15.32 13.16,8.97 14.99,7.14 19.37,7.14 19.38,7.13 24.41,7.13 28.22,3.33
MOSI
  Top 0.254: J2.3 14.48,12.09 14.28,11.89 14.28,9.32 14.71,8.89 16.79,8.89 16.81,8.86 18.59,8.86 19.05,9.32 23.22,9.32 28.6,3.94
N$3
  Top 0.305: J3.3 88.81,6.58 R2.1
N$4
  Top 0.254: R1.1 90.7,10.24 91.36,9.58 J3.9
N$12
  Top 0.203: C7.2 80.09,53.09 82.35,50.83 U2.1
N$13
  Top 0.25: U2.4 81.86,49.33 80.8,50.39 79.07,50.39 C15.2
N$14
  Top 0.254: U2.7 80.46,47.83 80.29,48.01 C14.2
N$15
  Top 0.203: 90.89,43.85 90.89,43.76 91.85,42.8 91.85,40.44 92.43,39.85 94.02,39.85 L1.1 94.41,39.99 94.41,42.28 95.69,43.56 D4.C
  Top 0.254: U2.25 90.89,43.85
N$16
  Top 0.254: U2.28 90.9,46.84 92.18,46.84 93.81,45.21 C17.1
N$17
  Top 0.203: C17.2 96.07,45.21 96.55,44.74 96.55,43.94 97.31,43.18 97.48,43.18 D7.C
  Top 0.254: D6.A 96.04,46.42 95.62,46 C17.2
N$19
  Top 0.203: U2.36 91.73,50.83 92.86,51.97 92.86,54.2 93.94,55.28 C21.1
OUT+
  Top 0.457: F1.2 79.87,34.47 79.87,34.6
P  (3 unrouted)
  Top 0.457: 70.65,31.65 C28.1 72.59,31.89 C5.1 74.99,31.97 75.56,31.39 C27.A 75.56,31.39 78.56,31.39 F1.1
P30
  Top 0.203: 92.33,47.83 93.01,47.83 93.29,47.55 93.8,47.55 93.83,47.58 95.18,47.58 96.04,48.44 D6.C 97.16,48.85 97.33,49.02 C19.1
  Top 0.254: U2.30 92.33,47.83
P31
  Top 0.203: R10.2 95.73,49.77 R11.1
  Top 0.254: U2.31 94.29,48.33 R10.2
P33  (via drill 0.35)
  Top 0.203: U2.33 92.4,49.33 v92.53,49.46 | v92.07,52.1 92.48,52.5 92.48,54.36 92.84,54.71 92.84,58.03 R12.1 93.64,59.03 R13.2
  Bottom 0.203: v92.53,49.46 92.53,51.64 v92.07,52.1
P34
  Top 0.203: U2.34 91.94,49.83 92.97,50.86 93.45,50.86 94.08,51.49 C22.2 D9.A
P36
  Top 0.203: D9.C 96.38,55 C21.2 96.37,56.45 96.37,56.67 D8.A
P37
  Top 0.203: U2.42 U2.43 87.2,52.35 85.45,54.09 85.45,55.61 85.5,55.65 85.5,55.78 85.98,56.26 89.82,56.26 90.1,55.98 | 90.17,51.55 U2.37 90.51,51.52 91.74,52.76 C25.1 91.38,54.01 90.93,54.46 90.93,55.15 D10.C | C24.1 90.1,55.98 | 90.1,55.98 D10.C | D10.C 90.3,55.91
P40
  Top 0.203: U2.40 88.7,52.1 89.05,52.45 89.05,53.77 88.83,53.99 L2.2 90.17,53.73 D10.A
SCK
  Top 0.254: J2.5 19.21,14.29 28.96,4.55
SCL  (via drill 0.35)
  Top 0.254: U2.17 86.7,41.45 87.86,40.29 87.86,21.54 84.72,18.4 76.82,18.4 75.53,17.11 R8.1 75.43,14.76 v73.89,14.76
  Bottom 0.254: v73.89,14.76 73.02,14.76 71.53,13.26 71.53,8.31
SDA  (via drill 0.35)
  Top 0.254: U2.18 87.2,41.65 88.34,40.51 88.34,21.29 84.78,17.73 76.81,17.73 76.4,17.32 76.4,15.48 76.4,13.95 R9.1 75.73,13.39 v73.89,13.39
  Bottom 0.254: v73.89,13.39 72.9,13.39 72.03,12.52 72.03,7.98
USB+  (1 unrouted)
  Top 0.254: U3.6 83.69,6.27 76.3,6.27 75.08,7.49 73.46,7.49 72.67,6.71 72.16,6.71
USB-  (1 unrouted)
  Top 0.254: U3.4 85.03,9.03 82.73,6.73 77.11,6.73 75.39,8.46
VBAT  (via drill 0.4)
  Top 0.254: C4.1 82.41,8.99 v83.46,8.99
  Top 0.406: C4.1 83.01,10.35 Q1.2
  Top 0.457: v92.23,21.44 94.89,21.44 J4.1
  Bottom 0.254: v83.46,8.99 89.86,15.39 90.63,15.39 91.69,16.46 91.69,20.9 v92.23,21.44
VBUS  (via drill 0.35)
  Top 0.203: J3.2 92.45,5.8 92.39,5.8 92.38,5.79 | U3.5 85.55,8.43 85.88,8.43 86.11,8.2 86.11,6.02 86.33,5.79 | J3.11 94.14,10.68
  Top 0.25: J3.2 92.73,5.98
  Top 0.254: 94.06,15.04 94.95,14.14 94.95,10.35 94.72,10.11 | 94.06,15.04 93.8,15.29 | 94.14,10.68 94.72,10.11 | 94.72,10.11 94.72,6.58 94.12,5.98 92.73,5.98 J3.2 | J3.11 91.78,10.68 91.29,11.18 89.06,11.18 R3.1 87.42,10.35 Q1.3 | 92.38,5.79 86.33,5.79 74.52,5.79 v73.89,6.43 | D1.A 87.46,15.9 93.19,15.9 94.06,15.04
  Bottom 0.254: v73.89,6.43 73.94,6.38 73.94,5.13 71.68,2.87
VIN  (via drill 0.35)
  Top 0.203: 84.89,13.28 Q1.1 82.89,12.25 82.18,12.97 C2.1 | 78.61,43.38 v78.23,43 78.31,43.08 C9.1
  Top 0.254: 78.23,44.69 C9.1 | C9.1 C10.1 81.9,44.77 83.47,46.33 U2.10 | 78.61,43.38 79.55,43.38 79.74,43.19 C11.1 79.74,40.64 C12.1 79.72,39.31 81.22,37.81 v81.25,37.85 | U2.24 90.2,39.78 90.14,39.73 v90.14,39.68 | v86.08,55.35 86.36,55.07 L2.1 | C9.1 77.25,44.77 74.85,47.17 74.85,53.9 75.82,54.86 v75.89,54.79 81.6,54.79 C23.2 | 84.89,13.28 87.38,13.28 IC1.1 88.49,15.37 88.57,15.44 90.14,15.44 90.4,15.19 90.4,14.42 IC1.3 | v79.27,14.81 79.45,14.99 80.11,14.99 80.37,15.24 D1.C 82.5,13.58 81.89,12.97
  Top 0.406: C2.1 81.89,12.97
  Bottom 0.254: v78.23,43 78.23,19.46 79.63,18.06 79.63,16.05 79.27,15.69 v79.27,14.81 | v90.14,39.68 90.14,39.34 88.59,37.8 81.3,37.8 v81.25,37.85 | v86.08,55.35 85.72,54.99 84.78,54.99 80.01,54.99 79.81,54.79 v75.89,54.79
VNEG-IN  (via drill 0.35, 0.4)
  Top 0.203: 92.49,43.67 92.6,43.56 D4.A
  Top 0.254: U2.16 86.2,42.92 v85.79,42.51 85.71,42.43 C13.2 85.71,38.07 C16.2 | U2.26 U2.27 | U2.22 89.2,43.61 v89.18,43.59 | U2.26 | U2.26 91.8,45.83 v92.2,45.43 92.2,43.96 92.49,43.67
  Bottom 0.25: v89.18,43.59 88.1,42.51 v85.79,42.51
  Bottom 0.254: v89.18,43.59 89.26,43.51 91.62,43.51 92.3,44.2 92.3,45.33 v92.2,45.43
XCL  (via drill 0.35)
  Top 0.254: v45.44,40.87 45.47,40.87 46.98,39.36 | v35.61,50.72 34.11,52.22 23.22,52.22 J1.8
  Bottom 0.254: v45.44,40.87 40.23,40.87 35.64,45.47 35.64,50.72 v35.61,50.72
XSTL  (via drill 0.35)
  Top 0.254: 45.61,38.52 45.61,39.02 43.65,40.97 v33.25,40.97 | v28.98,50.93 28.02,50.93 27.33,50.24 J1.12
  Bottom 0.254: v33.25,40.97 28.98,45.24 v28.98,50.93

### Text on the board
tNames: IN FROM BAT | to charge / module | - +